# Altium schematic sheet AT24C02.SchDoc: 李德勇
size A
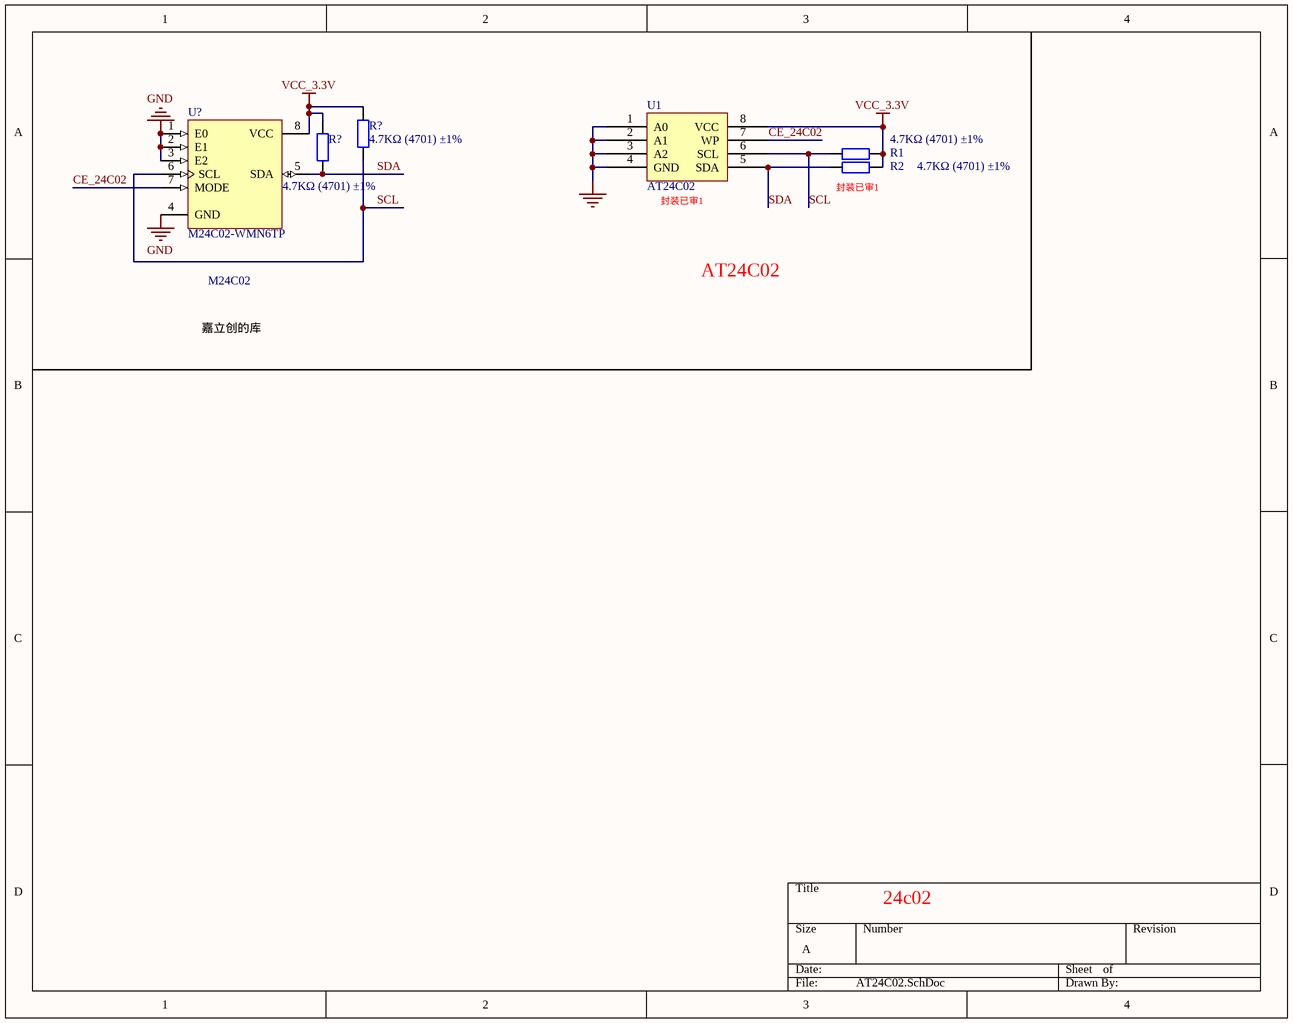
[diagram p0: AT24C02.SchDoc]

## Parts
(Parts that share a designator on the sheet are numbered #1, #2 ... from top to bottom, then left to right.)
R1  4.7KΩ (4701) ±1%  [RESC_0603_2]
R2  4.7KΩ (4701) ±1%  [RESC_0603_2]
R?#1  4.7KΩ (4701) ±1%  [RESC_0603_2]
R?#2  4.7KΩ (4701) ±1%  [RESC_0603_2]
U1  AT24C02  [SOIC_8]
U?  M24C02-WMN6TP  [SOIC-8_150mil]

## Nets
GND: U1.1(A0) U1.2(A1) U1.3(A2) U1.4(GND) U?.1(E0) U?.2(E1) U?.3(E2) U?.4(GND)
VCC_3.3V: R1.1 R2.2 R?#1.2 R?#2.2 U1.8(VCC) U?.8(VCC)
CE_24C02: U1.7(WP) U?.7(MODE)
SCL: R1.2 R?#1.1 U1.6(SCL) U?.6(SCL)
SDA: R2.1 R?#2.1 U1.5(SDA) U?.5(SDA)

## Notes on the sheet
- (near U1) 封装已审1
- (near R2) 封装已审1
- M24C02
- AT24C02
- 嘉立创的库
- 24c02

## Library data of the parts
R1 R2 R?#1 R?#2 = 0603 4.7KΩ (4701) 1%: 贴片电阻; ComponentLink1Description: 供应商链接; ComponentLink1URL: http://www.szlcsc.com/product/details_23889.html; Package: 0603; Supplier: LC; SuppliersPartNumber: C23162
U1 = Component_1
U? = M24C02-WMN6TP_[C7562]: EEPROM; ComponentLink1Description: 供应商链接; ComponentLink1URL: http://www.szlcsc.com/product/details_8039.html; Package: SOIC-8_150mil; Supplier: LC; SuppliersPartNumber: C7562